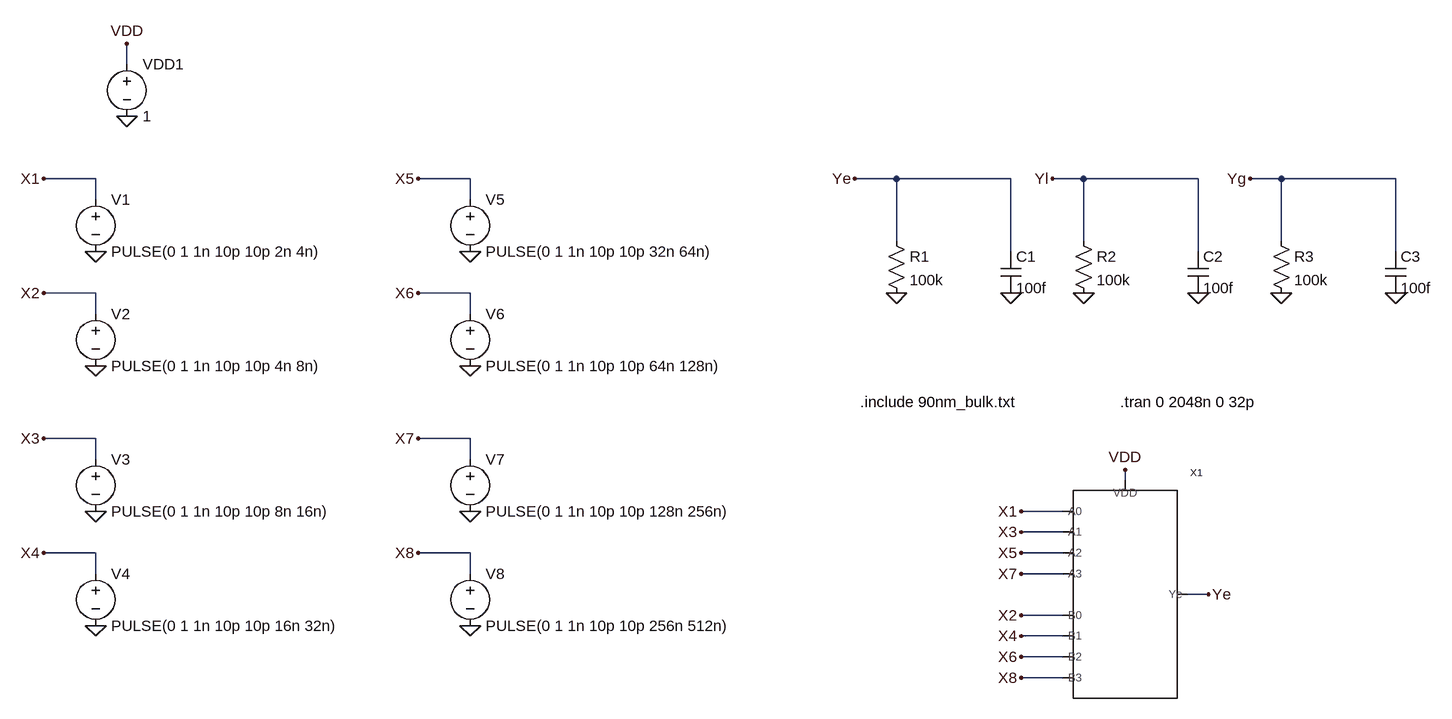
[diagram p0: schematic full-comparator4-sym-test.asc]
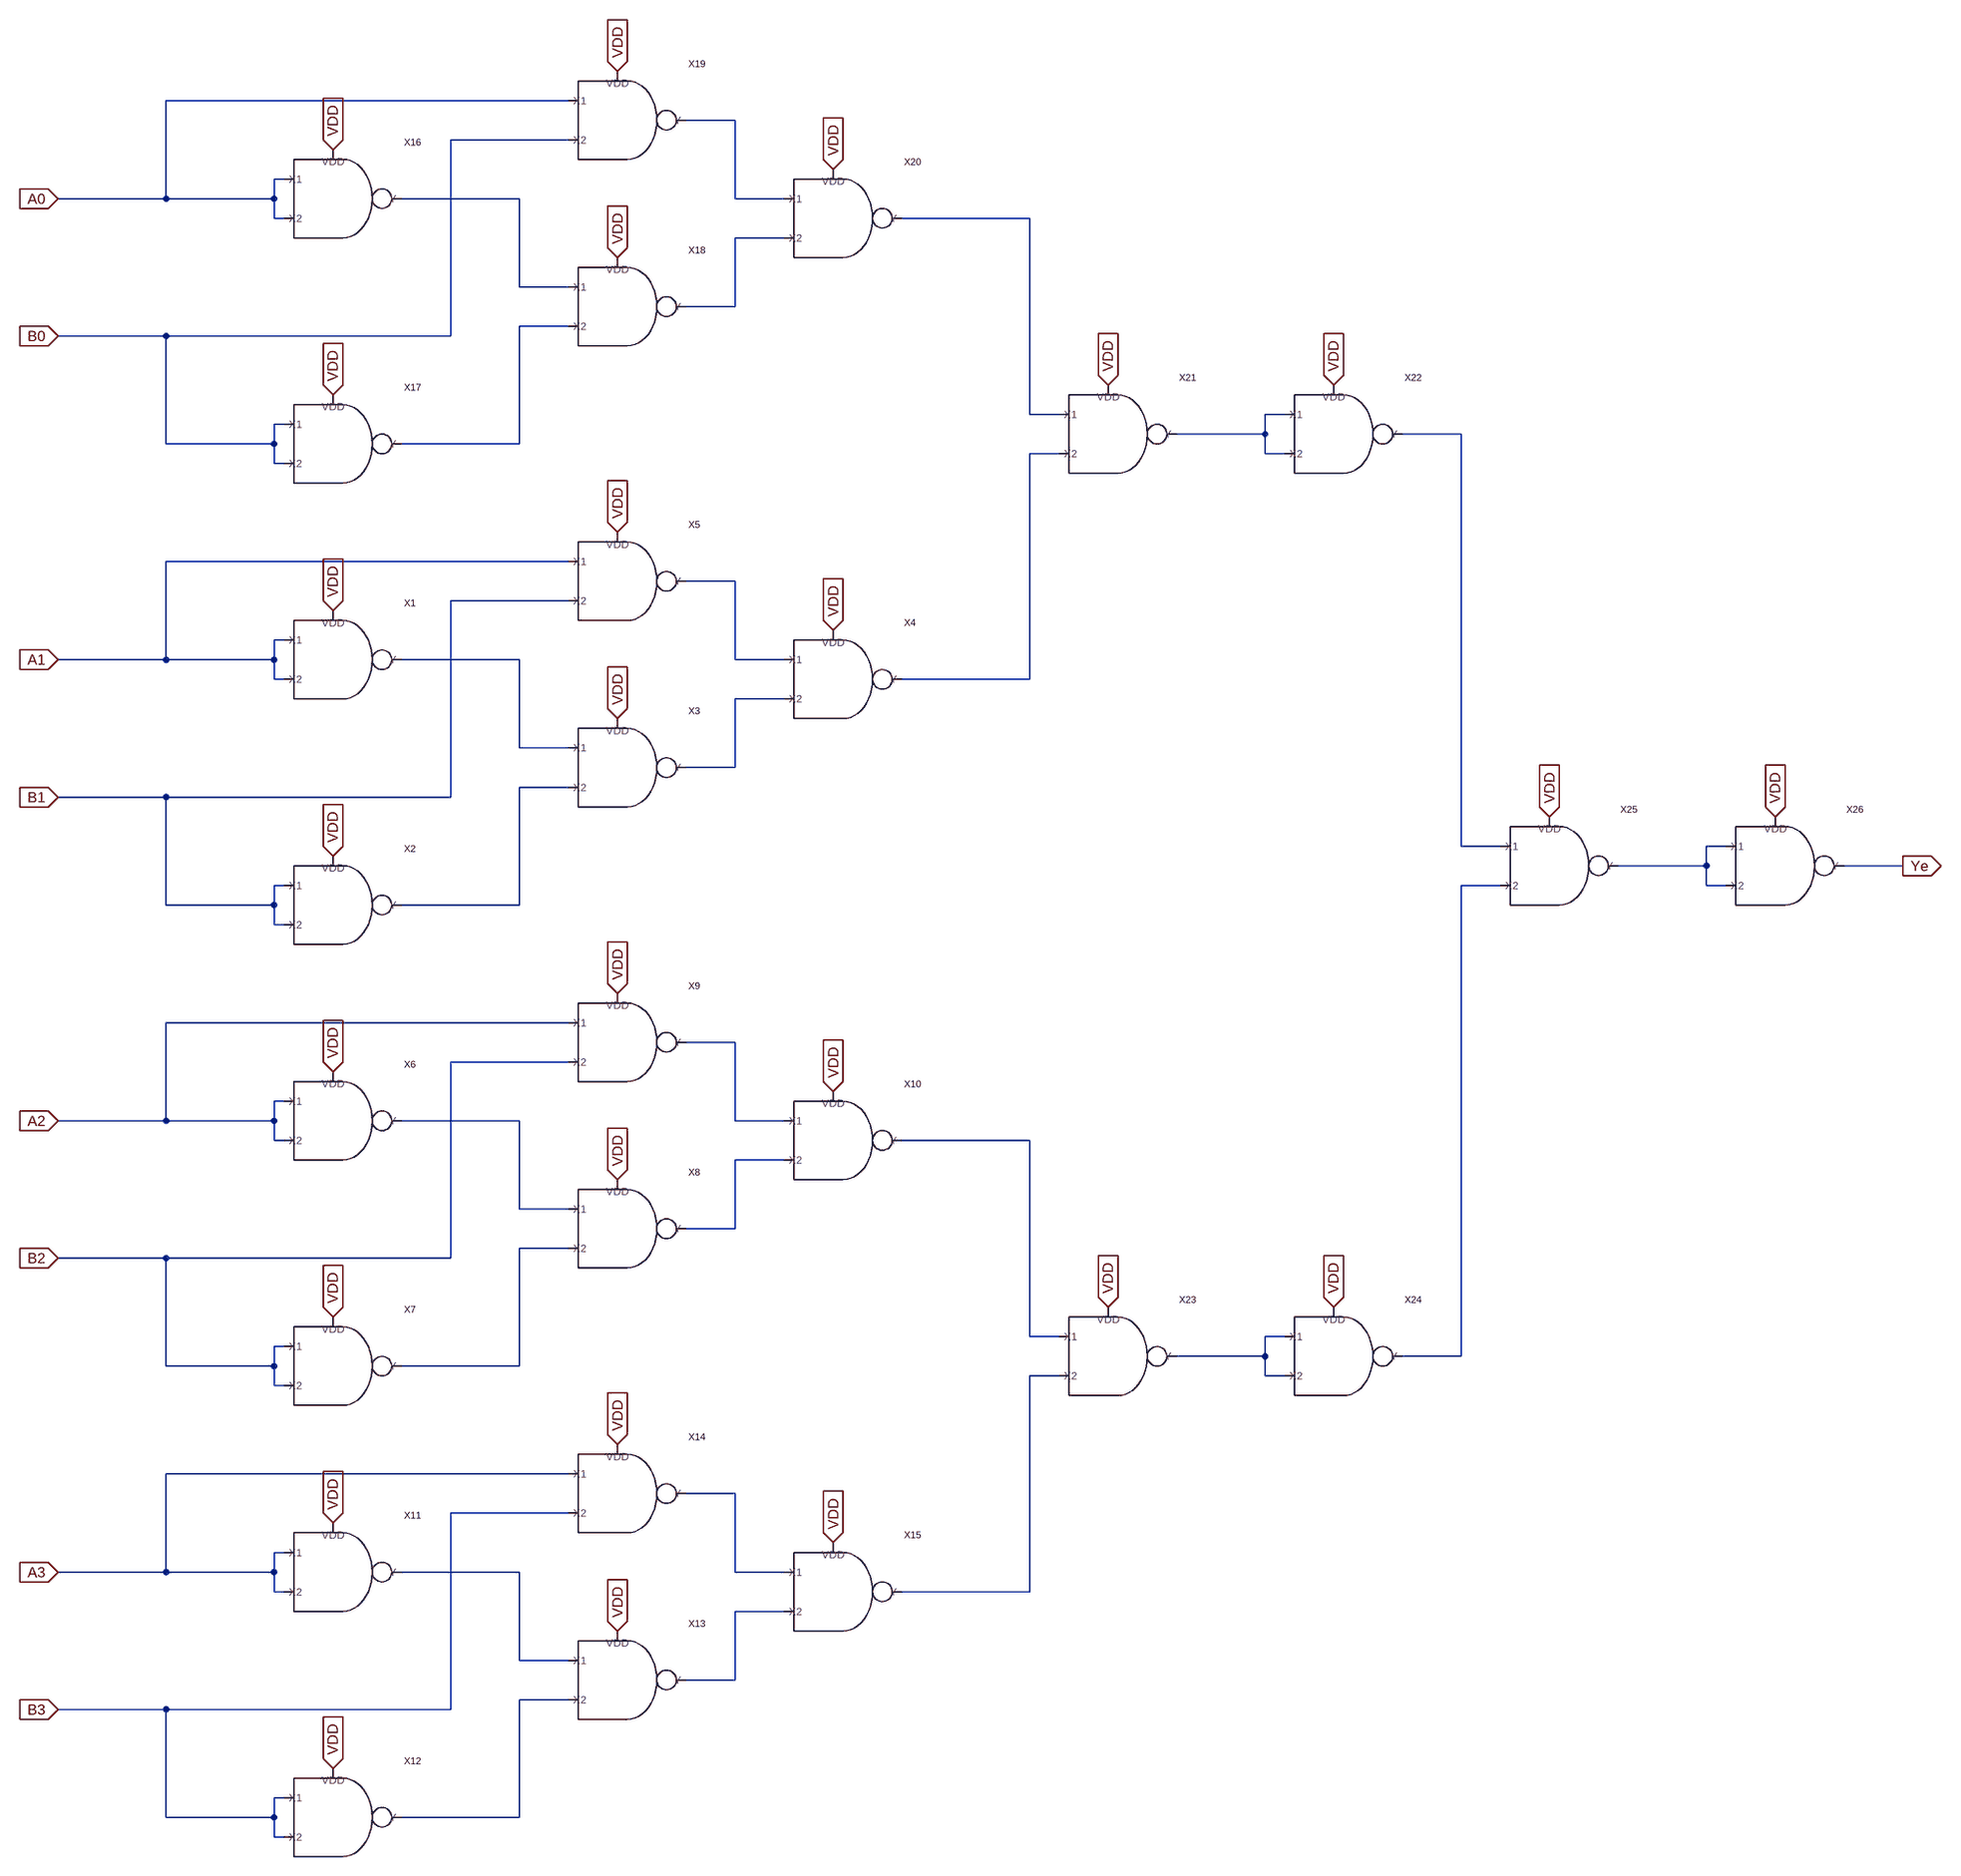
[diagram p1: sub-circuit full-comparator4.asc]
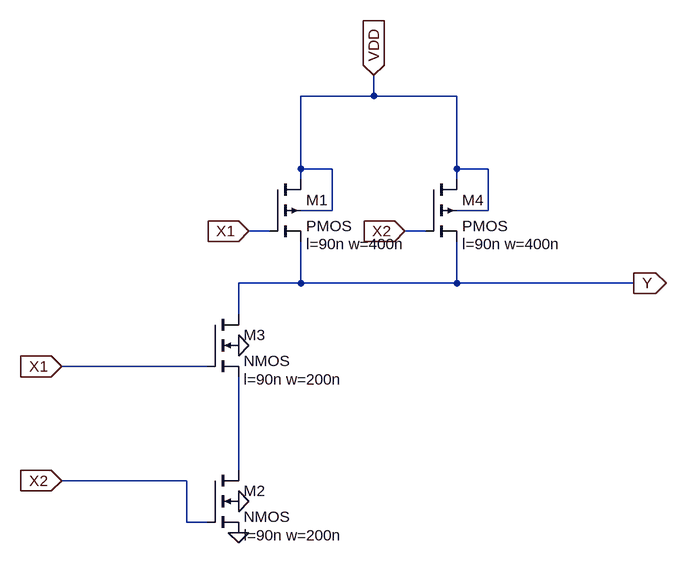
[diagram p2: sub-circuit nand.asc]
full-comparator4-sym-test.asc, the LTspice schematic file:
Version 4
SHEET 1 1104 860
WIRE -912 -144 -912 -176
WIRE -960 32 -1040 32
WIRE -384 32 -464 32
WIRE 272 32 208 32
WIRE 448 32 272 32
WIRE 560 32 512 32
WIRE 736 32 560 32
WIRE 864 32 816 32
WIRE 1040 32 864 32
WIRE -960 64 -960 32
WIRE -384 64 -384 32
WIRE 272 128 272 32
WIRE 560 128 560 32
WIRE 864 128 864 32
WIRE 448 144 448 32
WIRE 736 144 736 32
WIRE 1040 144 1040 32
WIRE -960 208 -1040 208
WIRE -384 208 -464 208
WIRE -960 240 -960 208
WIRE -384 240 -384 208
WIRE -960 432 -1040 432
WIRE -384 432 -464 432
WIRE -960 464 -960 432
WIRE -384 464 -384 432
WIRE 624 496 624 480
WIRE 528 544 464 544
WIRE 528 576 464 576
WIRE -960 608 -1040 608
WIRE -384 608 -464 608
WIRE 528 608 464 608
WIRE -960 640 -960 608
WIRE -384 640 -384 608
WIRE 528 640 464 640
WIRE 752 672 720 672
WIRE 528 704 464 704
WIRE 528 736 464 736
WIRE 528 768 464 768
WIRE 528 800 464 800
FLAG -960 144 0
FLAG -960 320 0
FLAG -1040 32 X1
FLAG -1040 208 X2
FLAG -912 -64 0
FLAG -912 -176 VDD
FLAG 448 208 0
FLAG 272 208 0
FLAG -960 544 0
FLAG -1040 432 X3
FLAG -960 720 0
FLAG -1040 608 X4
FLAG -384 144 0
FLAG -384 320 0
FLAG -464 32 X5
FLAG -464 208 X6
FLAG -384 544 0
FLAG -464 432 X7
FLAG -384 720 0
FLAG -464 608 X8
FLAG 208 32 Ye
FLAG 736 208 0
FLAG 560 208 0
FLAG 512 32 Yl
FLAG 1040 208 0
FLAG 864 208 0
FLAG 816 32 Yg
FLAG 624 480 VDD
FLAG 752 672 Ye
FLAG 464 544 X1
FLAG 464 576 X3
FLAG 464 608 X5
FLAG 464 640 X7
FLAG 464 704 X2
FLAG 464 736 X4
FLAG 464 768 X6
FLAG 464 800 X8
SYMBOL voltage -960 48 R0
WINDOW 123 0 0 Left 0
WINDOW 39 0 0 Left 0
SYMATTR InstName V1
SYMATTR Value PULSE(0 1 1n 10p 10p 2n 4n)
SYMBOL voltage -912 -160 R0
WINDOW 123 0 0 Left 0
WINDOW 39 0 0 Left 0
SYMATTR InstName VDD1
SYMATTR Value 1
SYMBOL voltage -960 224 R0
WINDOW 123 0 0 Left 0
WINDOW 39 0 0 Left 0
SYMATTR InstName V2
SYMATTR Value PULSE(0 1 1n 10p 10p 4n 8n)
SYMBOL res 256 112 R0
SYMATTR InstName R1
SYMATTR Value 100k
SYMBOL cap 432 144 R0
SYMATTR InstName C1
SYMATTR Value 100f
SYMBOL voltage -960 448 R0
WINDOW 123 0 0 Left 0
WINDOW 39 0 0 Left 0
SYMATTR InstName V3
SYMATTR Value PULSE(0 1 1n 10p 10p 8n 16n)
SYMBOL voltage -960 624 R0
WINDOW 123 0 0 Left 0
WINDOW 39 0 0 Left 0
SYMATTR InstName V4
SYMATTR Value PULSE(0 1 1n 10p 10p 16n 32n)
SYMBOL voltage -384 48 R0
WINDOW 123 0 0 Left 0
WINDOW 39 0 0 Left 0
SYMATTR InstName V5
SYMATTR Value PULSE(0 1 1n 10p 10p 32n 64n)
SYMBOL voltage -384 224 R0
WINDOW 123 0 0 Left 0
WINDOW 39 0 0 Left 0
SYMATTR InstName V6
SYMATTR Value PULSE(0 1 1n 10p 10p 64n 128n)
SYMBOL voltage -384 448 R0
WINDOW 123 0 0 Left 0
WINDOW 39 0 0 Left 0
SYMATTR InstName V7
SYMATTR Value PULSE(0 1 1n 10p 10p 128n 256n)
SYMBOL voltage -384 624 R0
WINDOW 123 0 0 Left 0
WINDOW 39 0 0 Left 0
SYMATTR InstName V8
SYMATTR Value PULSE(0 1 1n 10p 10p 256n 512n)
SYMBOL res 544 112 R0
SYMATTR InstName R2
SYMATTR Value 100k
SYMBOL cap 720 144 R0
SYMATTR InstName C2
SYMATTR Value 100f
SYMBOL res 848 112 R0
SYMATTR InstName R3
SYMATTR Value 100k
SYMBOL cap 1024 144 R0
SYMATTR InstName C3
SYMATTR Value 100f
SYMBOL full-comparator4 624 672 R0
SYMATTR InstName X1
TEXT 216 376 Left 2 !.include 90nm_bulk.txt
TEXT 616 376 Left 2 !.tran 0 2048n 0 32p

full-comparator4.asc, the sub-circuit schematic file:
Version 4
SHEET 1 2312 1092
WIRE 48 -3264 -608 -3264
WIRE 320 -3232 240 -3232
WIRE 48 -3200 -144 -3200
WIRE -416 -3136 -432 -3136
WIRE -608 -3104 -608 -3264
WIRE -608 -3104 -784 -3104
WIRE -432 -3104 -432 -3136
WIRE -432 -3104 -608 -3104
WIRE -32 -3104 -224 -3104
WIRE 320 -3104 320 -3232
WIRE 400 -3104 320 -3104
WIRE -432 -3072 -432 -3104
WIRE -416 -3072 -432 -3072
WIRE 800 -3072 592 -3072
WIRE 400 -3040 320 -3040
WIRE -32 -2960 -32 -3104
WIRE 48 -2960 -32 -2960
WIRE 320 -2928 320 -3040
WIRE 320 -2928 240 -2928
WIRE 48 -2896 -32 -2896
WIRE -608 -2880 -784 -2880
WIRE -144 -2880 -144 -3200
WIRE -144 -2880 -608 -2880
WIRE 800 -2752 800 -3072
WIRE 848 -2752 800 -2752
WIRE 1216 -2752 1184 -2752
WIRE -416 -2736 -432 -2736
WIRE 1184 -2720 1184 -2752
WIRE 1184 -2720 1040 -2720
WIRE 1504 -2720 1408 -2720
WIRE -608 -2704 -608 -2880
WIRE -432 -2704 -432 -2736
WIRE -432 -2704 -608 -2704
WIRE -32 -2704 -32 -2896
WIRE -32 -2704 -224 -2704
WIRE 848 -2688 800 -2688
WIRE 1184 -2688 1184 -2720
WIRE 1216 -2688 1184 -2688
WIRE -432 -2672 -432 -2704
WIRE -416 -2672 -432 -2672
WIRE 48 -2512 -608 -2512
WIRE 320 -2480 240 -2480
WIRE 48 -2448 -144 -2448
WIRE -416 -2384 -432 -2384
WIRE -608 -2352 -608 -2512
WIRE -608 -2352 -784 -2352
WIRE -432 -2352 -432 -2384
WIRE -432 -2352 -608 -2352
WIRE -32 -2352 -224 -2352
WIRE 320 -2352 320 -2480
WIRE 400 -2352 320 -2352
WIRE -432 -2320 -432 -2352
WIRE -416 -2320 -432 -2320
WIRE 800 -2320 800 -2688
WIRE 800 -2320 592 -2320
WIRE 400 -2288 320 -2288
WIRE -32 -2208 -32 -2352
WIRE 48 -2208 -32 -2208
WIRE 320 -2176 320 -2288
WIRE 320 -2176 240 -2176
WIRE 48 -2144 -32 -2144
WIRE -608 -2128 -784 -2128
WIRE -144 -2128 -144 -2448
WIRE -144 -2128 -608 -2128
WIRE 1504 -2048 1504 -2720
WIRE 1568 -2048 1504 -2048
WIRE 1936 -2048 1904 -2048
WIRE 1904 -2016 1904 -2048
WIRE 1904 -2016 1760 -2016
WIRE 2224 -2016 2128 -2016
WIRE -416 -1984 -432 -1984
WIRE 1568 -1984 1504 -1984
WIRE 1904 -1984 1904 -2016
WIRE 1936 -1984 1904 -1984
WIRE -608 -1952 -608 -2128
WIRE -432 -1952 -432 -1984
WIRE -432 -1952 -608 -1952
WIRE -32 -1952 -32 -2144
WIRE -32 -1952 -224 -1952
WIRE -432 -1920 -432 -1952
WIRE -416 -1920 -432 -1920
WIRE 48 -1760 -608 -1760
WIRE 320 -1728 240 -1728
WIRE 48 -1696 -144 -1696
WIRE -416 -1632 -432 -1632
WIRE -608 -1600 -608 -1760
WIRE -608 -1600 -784 -1600
WIRE -432 -1600 -432 -1632
WIRE -432 -1600 -608 -1600
WIRE -32 -1600 -224 -1600
WIRE 320 -1600 320 -1728
WIRE 400 -1600 320 -1600
WIRE -432 -1568 -432 -1600
WIRE -416 -1568 -432 -1568
WIRE 800 -1568 592 -1568
WIRE 400 -1536 320 -1536
WIRE -32 -1456 -32 -1600
WIRE 48 -1456 -32 -1456
WIRE 320 -1424 320 -1536
WIRE 320 -1424 240 -1424
WIRE 48 -1392 -32 -1392
WIRE -608 -1376 -784 -1376
WIRE -144 -1376 -144 -1696
WIRE -144 -1376 -608 -1376
WIRE 800 -1248 800 -1568
WIRE 848 -1248 800 -1248
WIRE 1216 -1248 1184 -1248
WIRE -416 -1232 -432 -1232
WIRE 1184 -1216 1184 -1248
WIRE 1184 -1216 1040 -1216
WIRE 1504 -1216 1504 -1984
WIRE 1504 -1216 1408 -1216
WIRE -608 -1200 -608 -1376
WIRE -432 -1200 -432 -1232
WIRE -432 -1200 -608 -1200
WIRE -32 -1200 -32 -1392
WIRE -32 -1200 -224 -1200
WIRE 848 -1184 800 -1184
WIRE 1184 -1184 1184 -1216
WIRE 1216 -1184 1184 -1184
WIRE -432 -1168 -432 -1200
WIRE -416 -1168 -432 -1168
WIRE 48 -1024 -608 -1024
WIRE 320 -992 240 -992
WIRE 48 -960 -144 -960
WIRE -416 -896 -432 -896
WIRE -608 -864 -608 -1024
WIRE -608 -864 -784 -864
WIRE -432 -864 -432 -896
WIRE -432 -864 -608 -864
WIRE -32 -864 -224 -864
WIRE 320 -864 320 -992
WIRE 400 -864 320 -864
WIRE -432 -832 -432 -864
WIRE -416 -832 -432 -832
WIRE 800 -832 800 -1184
WIRE 800 -832 592 -832
WIRE 400 -800 320 -800
WIRE -32 -720 -32 -864
WIRE 48 -720 -32 -720
WIRE 320 -688 320 -800
WIRE 320 -688 240 -688
WIRE 48 -656 -32 -656
WIRE -608 -640 -784 -640
WIRE -144 -640 -144 -960
WIRE -144 -640 -608 -640
WIRE -416 -496 -432 -496
WIRE -608 -464 -608 -640
WIRE -432 -464 -432 -496
WIRE -432 -464 -608 -464
WIRE -32 -464 -32 -656
WIRE -32 -464 -224 -464
WIRE -432 -432 -432 -464
WIRE -416 -432 -432 -432
FLAG -784 -2352 A1
IOPIN -784 -2352 In
FLAG -336 -2432 VDD
IOPIN -336 -2432 In
FLAG -784 -2128 B1
IOPIN -784 -2128 In
FLAG -336 -2032 VDD
IOPIN -336 -2032 In
FLAG 128 -2256 VDD
IOPIN 128 -2256 In
FLAG 128 -2560 VDD
IOPIN 128 -2560 In
FLAG 480 -2400 VDD
IOPIN 480 -2400 In
FLAG -784 -1600 A2
IOPIN -784 -1600 In
FLAG -336 -1680 VDD
IOPIN -336 -1680 In
FLAG -784 -1376 B2
IOPIN -784 -1376 In
FLAG -336 -1280 VDD
IOPIN -336 -1280 In
FLAG 128 -1504 VDD
IOPIN 128 -1504 In
FLAG 128 -1808 VDD
IOPIN 128 -1808 In
FLAG 480 -1648 VDD
IOPIN 480 -1648 In
FLAG -784 -864 A3
IOPIN -784 -864 In
FLAG -336 -944 VDD
IOPIN -336 -944 In
FLAG -784 -640 B3
IOPIN -784 -640 In
FLAG -336 -544 VDD
IOPIN -336 -544 In
FLAG 128 -768 VDD
IOPIN 128 -768 In
FLAG 128 -1072 VDD
IOPIN 128 -1072 In
FLAG 480 -912 VDD
IOPIN 480 -912 In
FLAG 2224 -2016 Ye
IOPIN 2224 -2016 Out
FLAG -784 -3104 A0
IOPIN -784 -3104 In
FLAG -336 -3184 VDD
IOPIN -336 -3184 In
FLAG -784 -2880 B0
IOPIN -784 -2880 In
FLAG -336 -2784 VDD
IOPIN -336 -2784 In
FLAG 128 -3008 VDD
IOPIN 128 -3008 In
FLAG 128 -3312 VDD
IOPIN 128 -3312 In
FLAG 480 -3152 VDD
IOPIN 480 -3152 In
FLAG 928 -2800 VDD
IOPIN 928 -2800 In
FLAG 1296 -2800 VDD
IOPIN 1296 -2800 In
FLAG 928 -1296 VDD
IOPIN 928 -1296 In
FLAG 1296 -1296 VDD
IOPIN 1296 -1296 In
FLAG 1648 -2096 VDD
IOPIN 1648 -2096 In
FLAG 2016 -2096 VDD
IOPIN 2016 -2096 In
SYMBOL nand -336 -2352 R0
SYMATTR InstName X1
SYMBOL nand -336 -1952 R0
SYMATTR InstName X2
SYMBOL nand 128 -2176 R0
SYMATTR InstName X3
SYMBOL nand 128 -2480 R0
SYMATTR InstName X5
SYMBOL nand 480 -2320 R0
SYMATTR InstName X4
SYMBOL nand -336 -1600 R0
SYMATTR InstName X6
SYMBOL nand -336 -1200 R0
SYMATTR InstName X7
SYMBOL nand 128 -1424 R0
SYMATTR InstName X8
SYMBOL nand 128 -1728 R0
SYMATTR InstName X9
SYMBOL nand 480 -1568 R0
SYMATTR InstName X10
SYMBOL nand -336 -864 R0
SYMATTR InstName X11
SYMBOL nand -336 -464 R0
SYMATTR InstName X12
SYMBOL nand 128 -688 R0
SYMATTR InstName X13
SYMBOL nand 128 -992 R0
SYMATTR InstName X14
SYMBOL nand 480 -832 R0
SYMATTR InstName X15
SYMBOL nand -336 -3104 R0
SYMATTR InstName X16
SYMBOL nand -336 -2704 R0
SYMATTR InstName X17
SYMBOL nand 128 -2928 R0
SYMATTR InstName X18
SYMBOL nand 128 -3232 R0
SYMATTR InstName X19
SYMBOL nand 480 -3072 R0
SYMATTR InstName X20
SYMBOL nand 928 -2720 R0
SYMATTR InstName X21
SYMBOL nand 1296 -2720 R0
SYMATTR InstName X22
SYMBOL nand 928 -1216 R0
SYMATTR InstName X23
SYMBOL nand 1296 -1216 R0
SYMATTR InstName X24
SYMBOL nand 1648 -2016 R0
SYMATTR InstName X25
SYMBOL nand 2016 -2016 R0
SYMATTR InstName X26

nand.asc, the sub-circuit schematic file:
Version 4
SHEET 1 1104 1140
WIRE 272 -16 272 -48
WIRE 272 -16 160 -16
WIRE 400 -16 272 -16
WIRE 160 96 160 -16
WIRE 208 96 160 96
WIRE 400 96 400 -16
WIRE 448 96 400 96
WIRE 160 112 160 96
WIRE 400 112 400 96
WIRE 208 160 208 96
WIRE 208 160 160 160
WIRE 448 160 448 96
WIRE 448 160 400 160
WIRE 112 192 80 192
WIRE 352 192 320 192
WIRE 160 272 160 208
WIRE 160 272 64 272
WIRE 400 272 400 208
WIRE 400 272 160 272
WIRE 672 272 400 272
WIRE 64 320 64 272
WIRE 16 400 -208 400
WIRE 64 560 64 416
WIRE -16 576 -208 576
WIRE -16 640 -16 576
WIRE 16 640 -16 640
FLAG -208 400 X1
IOPIN -208 400 In
FLAG -208 576 X2
IOPIN -208 576 In
FLAG 64 656 0
FLAG 64 608 0
FLAG 272 -48 VDD
IOPIN 272 -48 In
FLAG 80 192 X1
IOPIN 80 192 In
FLAG 320 192 X2
IOPIN 320 192 In
FLAG 672 272 Y
IOPIN 672 272 Out
FLAG 64 368 0
SYMBOL pmos4 112 112 R0
WINDOW 123 56 100 Left 2
SYMATTR Value2 l=90n w=400n
SYMATTR InstName M1
SYMBOL nmos4 16 560 R0
WINDOW 123 56 100 Left 2
SYMATTR Value2 l=90n w=200n
SYMATTR InstName M2
SYMBOL nmos4 16 320 R0
WINDOW 123 56 100 Left 2
SYMATTR Value2 l=90n w=200n
SYMATTR InstName M3
SYMBOL pmos4 352 112 R0
WINDOW 123 56 100 Left 2
SYMATTR Value2 l=90n w=400n
SYMATTR InstName M4

The netlist it stands for:
* full-comparator4-sym-test.asc
V1 X1 0 PULSE(0 1 1n 10p 10p 2n 4n)
VDD1 VDD 0 1
V2 X2 0 PULSE(0 1 1n 10p 10p 4n 8n)
R1 Ye 0 100k
C1 Ye 0 100f
V3 X3 0 PULSE(0 1 1n 10p 10p 8n 16n)
V4 X4 0 PULSE(0 1 1n 10p 10p 16n 32n)
V5 X5 0 PULSE(0 1 1n 10p 10p 32n 64n)
V6 X6 0 PULSE(0 1 1n 10p 10p 64n 128n)
V7 X7 0 PULSE(0 1 1n 10p 10p 128n 256n)
V8 X8 0 PULSE(0 1 1n 10p 10p 256n 512n)
R2 Yl 0 100k
C2 Yl 0 100f
R3 Yg 0 100k
C3 Yg 0 100f
XX1 VDD Ye X1 X3 X5 X7 X2 X4 X6 X8 full-comparator4

* block symbol definitions
.subckt full-comparator4 VDD Ye A0 A1 A2 A3 B0 B1 B2 B3
XX1 N010 A1 A1 VDD nand
XX2 N012 B1 B1 VDD nand
XX3 N011 N010 N012 VDD nand
XX5 N009 A1 B1 VDD nand
XX4 N008 N009 N011 VDD nand
XX6 N016 A2 A2 VDD nand
XX7 N019 B2 B2 VDD nand
XX8 N018 N016 N019 VDD nand
XX9 N015 A2 B2 VDD nand
XX10 N017 N015 N018 VDD nand
XX11 N023 A3 A3 VDD nand
XX12 N025 B3 B3 VDD nand
XX13 N024 N023 N025 VDD nand
XX14 N022 A3 B3 VDD nand
XX15 N021 N022 N024 VDD nand
XX16 N002 A0 A0 VDD nand
XX17 N005 B0 B0 VDD nand
XX18 N004 N002 N005 VDD nand
XX19 N001 A0 B0 VDD nand
XX20 N003 N001 N004 VDD nand
XX21 N006 N003 N008 VDD nand
XX22 N007 N006 N006 VDD nand
XX23 N020 N017 N021 VDD nand
XX24 N014 N020 N020 VDD nand
XX25 N013 N007 N014 VDD nand
XX26 Ye N013 N013 VDD nand
.ends full-comparator4

.subckt nand Y X1 X2 VDD
M1 VDD X1 Y VDD PMOS l=90n w=400n
M2 N001 X2 0 0 NMOS l=90n w=200n
M3 Y X1 N001 0 NMOS l=90n w=200n
M4 VDD X2 Y VDD PMOS l=90n w=400n
.ends nand

.model NMOS NMOS
.model PMOS PMOS
.lib standard.mos
.include 90nm_bulk.txt
.tran 0 2048n 0 32p
.backanno
.end